# EAGLE design scheme (EAGLE 6.5.0)
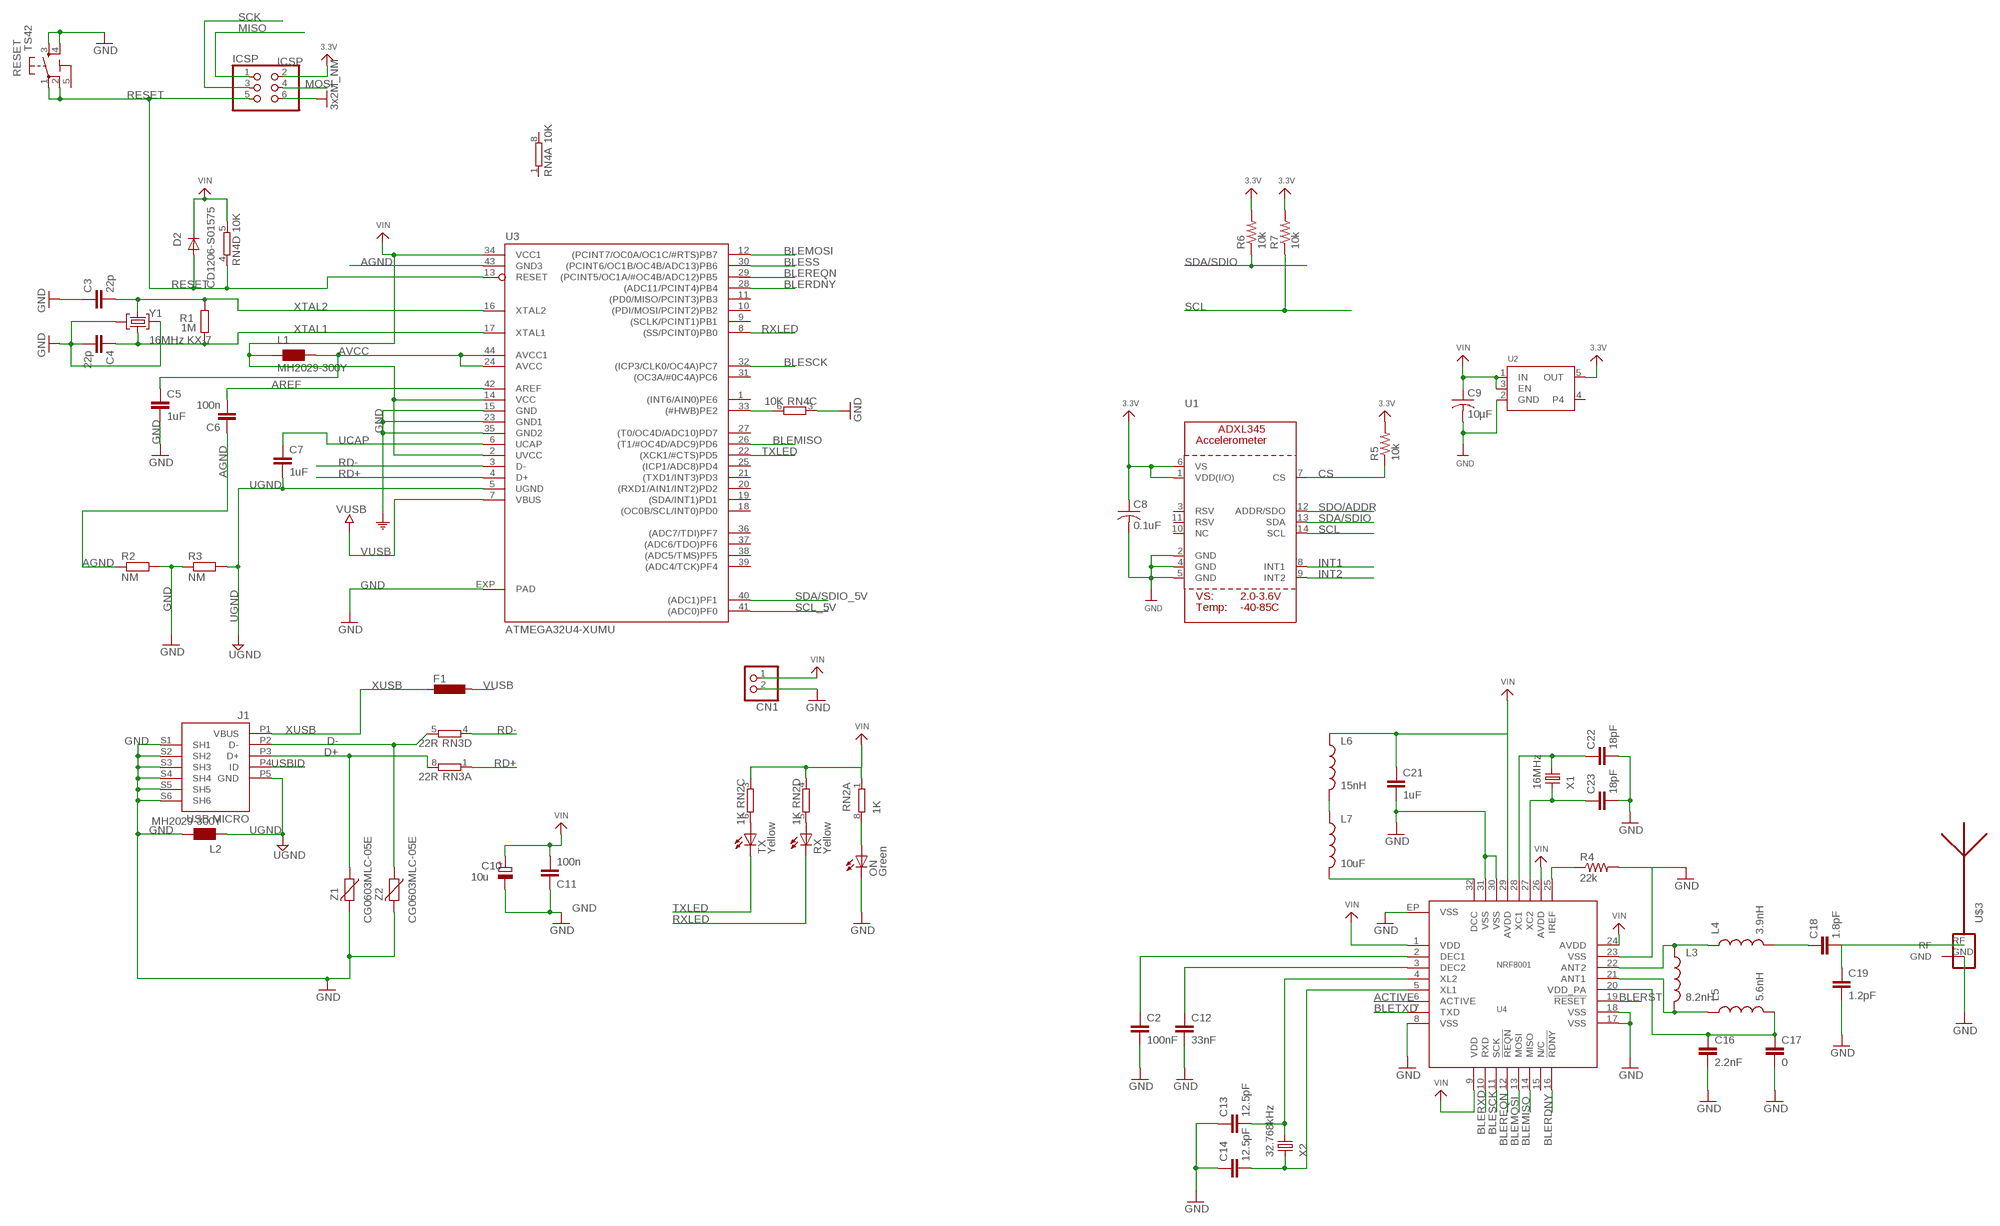
[diagram p0: schematic, sheet 1]

## Parts
C2  100nF  CAP0603-CAP  [0603-CAP]
C3  22p  C-EUC0603  [C0603-ROUND]
C4  22p  C-EUC0603  [C0603-ROUND]
C5  1uF  C-EUC0603  [C0603-ROUND]
C6  100n  C-EUC0603  [C0603-ROUND]
C7  1uF  C-EUC0603  [C0603-ROUND]
C8  0.1uF  C-USC0805  [C0805]
C9  10µF  C-USC0805  [C0805]
C10  10u  CPOL-EUSMCB  [SMC_B]
C11  100n  C-EUC0603  [C0603-ROUND]
C12  33nF  CAP0603-CAP  [0603-CAP]
C13  12.5pF  CAP0603-CAP  [0603-CAP]
C14  12.5pF  CAP0603-CAP  [0603-CAP]
C16  2.2nF  CAP0603-CAP  [0603-CAP]
C17  0  CAP0603-CAP  [0603-CAP]
C18  1.8pF  CAP0603-CAP  [0603-CAP]
C19  1.2pF  CAP0603-CAP  [0603-CAP]
C21  1uF  CAP0603-CAP  [0603-CAP]
C22  18pF  CAP0603-CAP  [0603-CAP]
C23  18pF  CAP0603-CAP  [0603-CAP]
CN1  JST_2PIN-SMT-RA  [JST-PH-2-SMT-RA]
D2  CD1206-S01575  DIODE-MINIMELF  [MINIMELF]
F1  MF-MSMF050-2 500mA  L-EUL1812  [L1812]
ICSP  ICSP  PINHD-2X3  [2X03]
J1  USB MICRO  MYCON2_USB-MINI-B  [CON2_USB_MICRO_B_AT]
L1  MH2029-300Y  WE-CBF_0805  [0805]
L2  MH2029-300Y  WE-CBF_0805  [0805]
L3  8.2nH  INDUCTOR0603  [0603]
L4  3.9nH  INDUCTOR0603  [0603]
L5  5.6nH  INDUCTOR0603  [0603]
L6  15nH  INDUCTOR0603  [0603]
L7  10uF  INDUCTOR0603  [0603]
ON  Green  LEDCHIPLED_0805  [CHIPLED_0805]
R1  1M  R-EU_R0603  [R0603-ROUND]
R2  NM  R-EU_R0402  [R0402]
R3  NM  R-EU_R0402  [R0402]
R4  22k  RESISTOR0603-RES  [0603-RES]
R5  10k  RESISTOR0603-RES  [0603-RES]
R6  10k  RESISTOR0603-RES  [0603-RES]
R7  10k  RESISTOR0603-RES  [0603-RES]
RESET  TS42  [TS42]
RN2  1K  4R-NCAY16  [CAY16]
RN3  22R  4R-NCAY16  [CAY16]
RN4  10K  4R-NCAY16  [CAY16]
RX  Yellow  LEDCHIPLED_0805  [CHIPLED_0805]
TX  Yellow  LEDCHIPLED_0805  [CHIPLED_0805]
U1  ACCEL_ADXL345  [LGA14]
U2  VREG_SOT23-5  [SOT23-5]
U3  ATMEGA32U4-XUMU  [QFN44ML7X7]
U4  NRF8001  [QFN-32]
U$3  ANTENNA_1LEFT  [SWRA117D_LEFT]
X1  16MHz  CRYSTAL-2.5X3.5  [CRYSTAL-2.5X3.5]
X2  32.768kHz  CRYSTAL-ABS10  [CRYSTAL-ABS10]
Y1  16MHz KX-7  CRYSTAL-3.2-2.5  [CRYSTAL-3.2-2.5]
Z1  CG0603MLC-05E  VARISTORCN0603  [CT/CN0603]
Z2  CG0603MLC-05E  VARISTORCN0603  [CT/CN0603]

## Nets
3.3V: C8.1 ICSP.2 R5.2 R6.2 R7.2 U1.1(VDD(I/O)) U1.6(VS) U2.5(OUT)
ACTIVE: U4.6(ACTIVE)
AGND: C6.1 R2.1 U3.43(GND3)
AREF [aref]: C6.2 U3.42(AREF)
AVCC: C5.1 L1.2 U3.24(AVCC) U3.44(AVCC1)
BLEMISO: U3.26((T1/#OC4D/ADC9)PD6) U4.14(MISO)
BLEMOSI: U3.12((PCINT7/OC0A/OC1C/#RTS)PB7) U4.13(MOSI)
BLERDNY: U3.28((ADC11/PCINT4)PB4) U4.16(!RDNY)
BLEREQN: U4.12(!REQN)
BLERST: U4.19(!RESET)
BLERXD: U4.10(RXD)
BLESCK: U3.32((ICP3/CLK0/OC4A)PC7) U4.11(SCK)
BLESS: U3.30((PCINT6/OC1B/OC4B/ADC13)PB6)
BLETXD: U4.7(TXD)
CS: R5.1 U1.7(CS)
D+: J1.P3(D+) RN3.8 Z1.1
D-: J1.P2(D-) RN3.5 Z2.1
GND: C2.2 C3.1 C4.2 C5.2 C8.2 C9.2 C10.- C11.1 C12.2 C13.1 C14.1 C16.2 C17.2 C19.2 C21.2 C22.2 C23.2 CN1.2 ICSP.6 J1.S1(SH1) J1.S2(SH2) J1.S3(SH3) J1.S4(SH4) J1.S5(SH5) J1.S6(SH6) L2.2 ON.C R2.2 R3.1 R4.2 RESET.3 RESET.4 RN4.3 U1.2(GND) U1.4(GND) U1.5(GND) U2.2(GND) U3.15(GND) U3.23(GND1) U3.35(GND2) U3.EXP(PAD) U4.8(VSS) U4.17(VSS) U4.18(VSS) U4.23(VSS) U4.30(VSS) U4.31(VSS) U4.EP(VSS) U$3.GND Y1.2(GND) Y1.4(GND) Z1.2 Z2.2 ; supply symbol labelled 3x2M_NM, COM
HWB: RN4.6
INT1: U1.8(INT1)
INT2: U1.9(INT2)
MISO: ICSP.1
MOSI: ICSP.4
N$1: L6.2 L7.1
N$2: L7.2 U4.32(DCC)
N$3: ON.A RN2.8
N$5: C2.1 U4.2(DEC1)
N$6: RN2.6 TX.A
N$7: C12.1 U4.3(DEC2)
N$8: RN2.5 RX.A
N$9: L3.1 L4.1 U4.22(ANT2)
N$10: L3.2 L5.1 U4.21(ANT1)
N$11: C18.1 L4.2
N$12: C18.2 C19.1 U$3.RF
N$13: C16.1 C17.1 L5.2 U4.20(VDD_PA)
N$14: R4.1 U4.25(IREF)
N$15: C23.1 U4.27(XC2) X1.P$1
N$16: C22.1 U4.28(XC1) X1.P$3
N$17: C13.2 U4.4(XL2) X2.P$2
N$18: C14.2 U4.5(XL1) X2.P$1
RD+: RN3.1 U3.4(D+)
RD-: RN3.4 U3.3(D-)
RESET: D2.A ICSP.5 RESET.1 RESET.2 RN4.4 U3.13(RESET)
RXLED: RX.C U3.8((SS/PCINT0)PB0)
SCK: ICSP.3
SCL: R7.1 U1.14(SCL)
SCL_5V: U3.41((ADC0)PF0)
SDA/SDIO: R6.1 U1.13(SDA)
SDA/SDIO_5V: U3.40((ADC1)PF1)
SDO/ADDR: U1.12(ADDR/SDO)
TXLED: TX.C U3.22((XCK1/#CTS)PD5)
UCAP: C7.1 U3.6(UCAP)
UGND [gnd]: C7.2 J1.P5(GND) L2.1 R3.2 U3.5(UGND)
USBID: J1.P4(ID)
VIN: C9.1 C10.+ C11.2 C21.1 CN1.1 D2.C L1.1 L6.1 RN2.1 RN2.3 RN2.4 RN4.5 U2.1(IN) U2.3(EN) U3.2(UVCC) U3.14(VCC) U3.34(VCC1) U4.1(VDD) U4.9(VDD) U4.24(AVDD) U4.26(AVDD) U4.29(AVDD)
VUSB: F1.1 U3.7(VBUS)
XTAL1: C4.1 R1.1 U3.17(XTAL1) Y1.1(C1)
XTAL2: C3.2 R1.2 U3.16(XTAL2) Y1.3(C2)
XUSB [usbvcc]: F1.2 J1.P1(VBUS)
Unconnected: RN2.2 RN2.7 RN3.2 RN3.3 RN3.6 RN3.7 RN4.1 RN4.2 RN4.7 RN4.8 U1.3(RSV) U1.10(NC) U1.11(RSV) U2.4 U3.1((INT6/AIN0)PE6) U3.9((SCLK/PCINT1)PB1) U3.10((PDI/MOSI/PCINT2)PB2) U3.11((PD0/MISO/PCINT3)PB3) U3.18((OC0B/SCL/INT0)PD0) U3.19((SDA/INT1)PD1) U3.20((RXD1/AIN1/INT2)PD2) U3.21((TXD1/INT3)PD3) U3.25((ICP1/ADC8)PD4) U3.27((T0/OC4D/ADC10)PD7) U3.29((PCINT5/OC1A/#OC4B/ADC12)PB5) U3.31((OC3A/#0C4A)PC6) U3.33((#HWB)PE2) U3.36((ADC7/TDI)PF7) U3.37((ADC6/TDO)PF6) U3.38((ADC5/TMS)PF5) U3.39((ADC4/TCK)PF4) U4.15(N/C)

## Power pins joined to a net without a drawn wire
5-GND: RESET.5(5-GND)

## Library data of the parts
C2 C12-C14 C16-C19 C21-C23 = SparkFun:CAP: Capacitor Standard 0603 ceramic capacitor, and 0.1" leaded capacitor.
C3-C7 C11 = SmartPrj:C-EU: CAPACITOR, European symbol
C8 C9 = adafruit:C-US: CAPACITOR, American symbol
C10 = rcl:CPOL-EU: POLARIZED CAPACITOR, European symbol
CN1 = adafruit:JST_2PIN: JST 2-Pin Connectors of various flavors SMT-RA (S2B-PH-SM4) 4UConnector #17311 SMT (B2B-PH-SM4) THM-RA (S2B-PH) THM (B2B-PH)
D2 = diode:DIODE-: DIODE
F1 = rcl:L-EU: INDUCTOR, European symbol
ICSP = SmartPrj:PINHD-2X3: PIN HEADER
J1 = SmartPrj:MYCON2_USB-MINI-B
L1 L2 = wuerth-elektronik:WE-CBF: SMD EMI Suppression Ferrite Beads - excellent anti-EMI properties - low DCR - impedances till 3000 ohms - rated current up to 6 A
L3-L7 = SparkFun:INDUCTOR: Inductors Basic Inductor/Choke - 0603 and 1206. Footprints are not proven and vary greatly between part numbers.
ON RX TX = led:LED: LED OSRAM: - CHIPLED LG R971, LG N971, LY N971, LG Q971, LY Q971, LO R971, LY R971 LH N974, LH R974 LS Q976, LO Q976, LY Q976 LO Q996 - Hyper CHIPLED LW Q18S LB Q993, LB Q99A, LB R99A - SideLED LS A670, LO A670, LY A670, LG A670, LP A670 LB A673, LV A673, LT A673, LW A673 LH A674 LY A675 LS A676, LA A676, LO A676, LY A676, LW A676 LS A679, LY A679, LG A679 - Hyper Micro SIDELED® LS Y876, LA Y876, LO Y876, LY Y876 LT Y87S - SmartLED LW L88C, LW L88S LB L89C, LB L89S, LG L890 LS L89K, LO L89K, LY L89K LS L896, LA L896, LO L896, LY L896 - TOPLED LS T670, LO T670, LY T670, LG T670, LP T670 LSG T670, LSP T670, LSY T670, LOP T670, LYG T670 LG T671, LOG T671, LSG T671 LB T673, LV T673, LT T673, LW T673 LH T674 LS T676, LA T676, LO T676, LY T676, LB T676, LH T676, LSB T676, LW T676 LB T67C, LV T67C, LT T67C, LS T67K, LO T67K, LY T67K, LW E67C LS E67B, LA E67B, LO E67B, LY E67B, LB E67C, LV E67C, LT E67C LW T67C LS T679, LY T679, LG T679 LS T770, LO T770, LY T770, LG T770, LP T770 LB T773, LV T773, LT T773, LW T773 LH T774 LS E675, LA E675, LY E675, LS T675 LS T776, LA T776, LO T776, LY T776, LB T776 LHGB T686 LT T68C, LB T68C - Hyper Mini TOPLED® LB M676 - Mini TOPLED Santana® LG M470 LS M47K, LO M47K, LY M47K Source: http://www.osram.convergy.de LUXEON: - LUMILED® LXK2-PW12-R00, LXK2-PW12-S00, LXK2-PW14-U00, LXK2-PW14-V00 LXK2-PM12-R00, LXK2-PM12-S00, LXK2-PM14-U00 LXK2-PE12-Q00, LXK2-PE12-R00, LXK2-PE12-S00, LXK2-PE14-T00, LXK2-PE14-U00 LXK2-PB12-K00, LXK2-PB12-L00, LXK2-PB12-M00, LXK2-PB14-N00, LXK2-PB14-P00, LXK2-PB14-Q00 LXK2-PR12-L00, LXK2-PR12-M00, LXK2-PR14-Q00, LXK2-PR14-R00 LXK2-PD12-Q00, LXK2-PD12-R00, LXK2-PD12-S00 LXK2-PH12-R00, LXK2-PH12-S00 LXK2-PL12-P00, LXK2-PL12-Q00, LXK2-PL12-R00 Source: www.luxeon.com KINGBRIGHT: KA-3528ASYC Source: www.kingbright.com
R1-R3 = SmartPrj:R-EU_: RESISTOR, European symbol
R4-R7 = SparkFun:RESISTOR: Resistor Basic schematic elements and footprints for 0603, 1206, and PTH resistors.
RESET = SmartPrj:TS42: TS42 Dongnan Electronics Tact switch VDC 12V - 50mA
RN2-RN4 = resistor-dil:4R-N: Array Chip Resistor Source: RS Component / Phycomp
U1 = microbuilder:ACCEL_ADXL345: ADXL345 - Digital 3-Axis Accelerometer (I2C/SPI)
U2 = microbuilder:VREG_SOT23-5: SOT23-5 Fixed Voltage Regulators Part Current Out V Out V In V Dropout θJA (°C/W) TJ (°C) Digikey Part No. ADP121 150mA 3.3V 3.4-5.5V 0.09V @ 150mA -- -- ADP121-AUJZ33R7CT-ND ADP121 150mA 3.0V 3.1-5.5V 0.09V @ 150mA -- -- ADP121-AUJZ30R7CT-ND ADP122 300mA 3.3V 3.4-5.5V 0.085V @ 300mA -- -- ADP122AUJZ-3.3-R7CT-ND ADP1712 300mA 3.3V 3.5-5.5V 0.17V @ 300mA -- -- ADP1712AUJZ-3.3-R7TR-ND AP7311 (Low Cost) 150mA 3.3V 3.5-6V 0.15V @ 150mA -- -- AP7311-33WG-7DICT-ND LD39015M18R 150mA 1.8V 1.9V-5.5V 0.08V @ 100mA -- -- 497-6977-1-ND LP2985A-33DBVR 150mA 3.3V 3.3-16V 0.28V @ 150mA 206 150 296-18479-1-ND MCP1824T-3302E/OT 300mA 3.3V 3.5V-6V 0.2V @ 300mA -- -- MCP1824T-3302E/OTCT-ND MIC5205-2.5YM5 TR 150mA 2.5V 2.7-16V 0.165V @ 150mA -- -- 576-1257-2-ND MIC5205-3.0YM5 TR 150mA 3.0V 3.2V-16V 0.165V @ 150mA -- -- 576-1258-2-ND MIC5205-3.3YM5 TR 150mA 3.3V 3.5V-16V 0.165V @ 150mA -- -- 576-1259-2-ND TPS780330220 150mA 3.3V+2.2V 3.6-5.5V 250mV Max -- -- 296-23332-1-ND TDA3663/N1,135 100mA 3.3V 3.5-45V 0.18V @ 50mA -- -- 568-5343-1-ND Max operating temp can be calculated using θJA, TJ (max junction temperature), and power in watts. Set the "Maximum Ambient Temperature" until it reaches TJ ("Max Junction Temperature"), which is the absolute limit for safe use of the regulator: Heat Sink Temperature Calculator <http://www.daycounter.com/Calculators/Heat-Sink-Temperature-Calculator.phtml> For example, With 12V source into a 3.3V LP2985 and a 30mA load, we are dissipating (12V-3.3V) * 0.03A = 0.261W. With a θJA of 206 °C/W, a TJ of 150°C, and 261mW we can safely use the chip without a heat sink up to 75°C (=147.1°C Junction Temperature).
U3 = SmartPrj:ATMEGA32U4-XU
U4 = FitnessDevice:NRF8001: nRF8001 is a Bluetooth® low energy solution designed for operation in the peripheral role. By integrating a Bluetooth low energy compliant radio (PHY), slave mode link controller and host, nRF8001 offers you an easy way to add Bluetooth low energy connectivity to your application.
U$3 = ant-planar-1:ANTENNA_1
X1 = FitnessDevice:CRYSTAL-2.5X3.5: ABRACON - ABM8G-16.000MHZ-B4Y-T - Crystal Newark Part Number: 60R3957
X2 = FitnessDevice:CRYSTAL-ABS10: ABS10-32.768KHZ-9-T
Y1 = SmartPrj:CRYSTAL-3.2-2.5
Z1 Z2 = varistor:VARISTOR: VARISTOR

## Net classes
1 power: width 0.254 mm, drill 0.61 mm, clearance 0.254 mm
2 gnd: width 0.254 mm, drill 0.61 mm, clearance 0.254 mm
3 usbvcc: width 0.254 mm, drill 0.61 mm, clearance 0.254 mm
4 aref: width 0.254 mm, drill 0.61 mm, clearance 0.254 mm

## Board
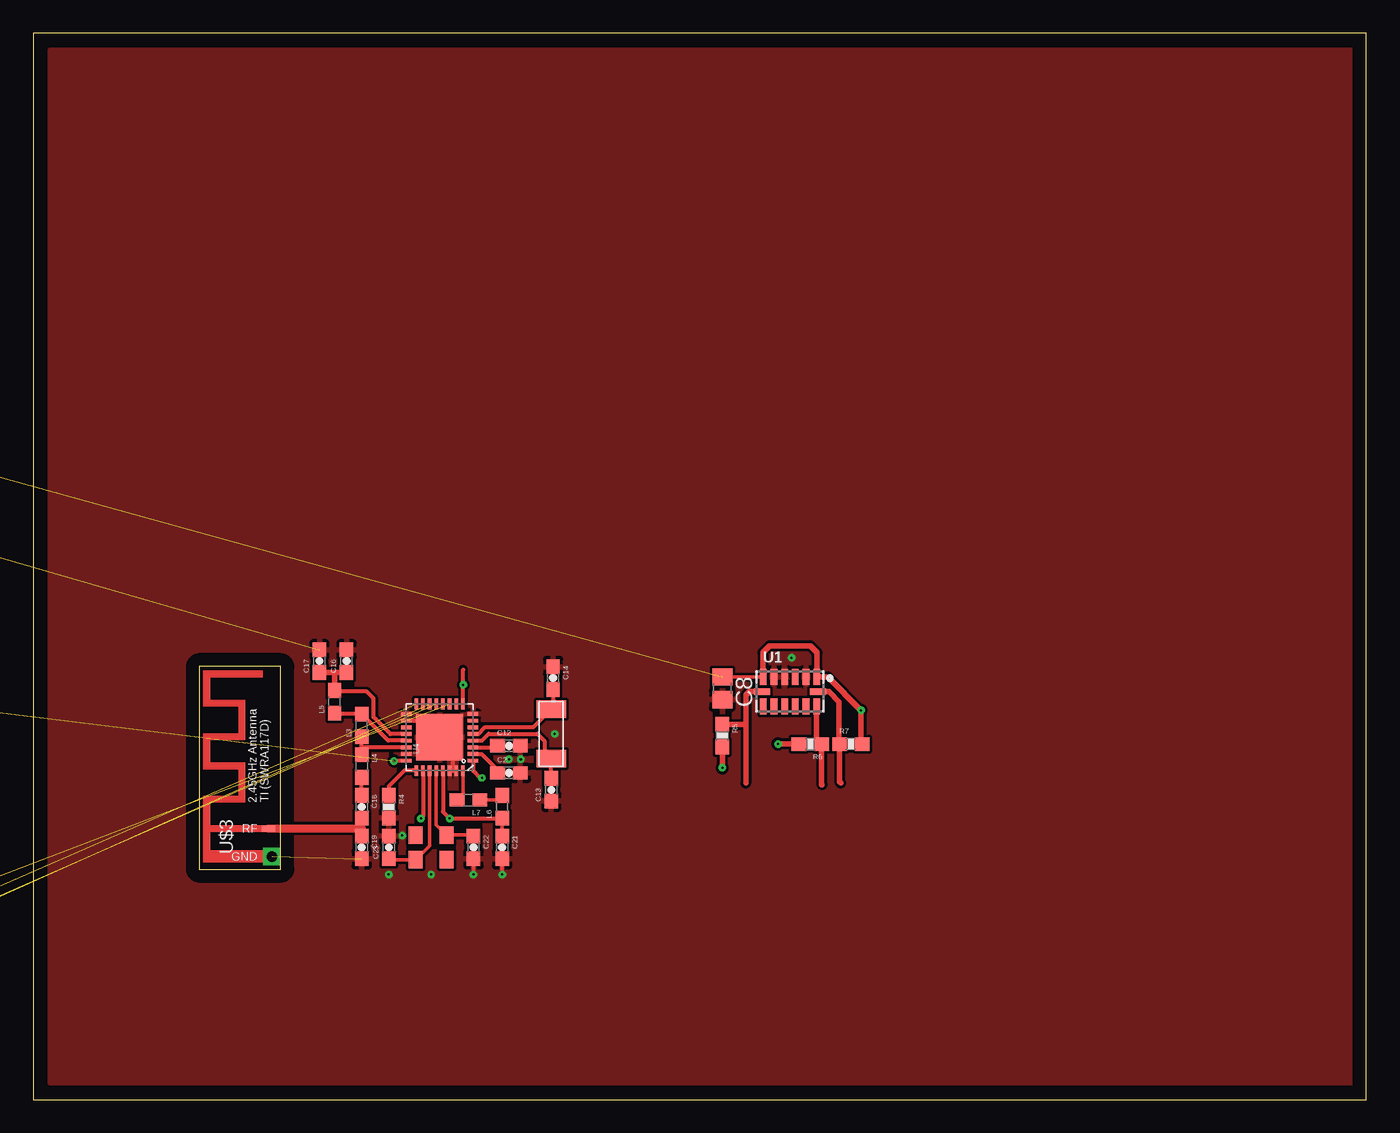
[diagram p1: board, top side]
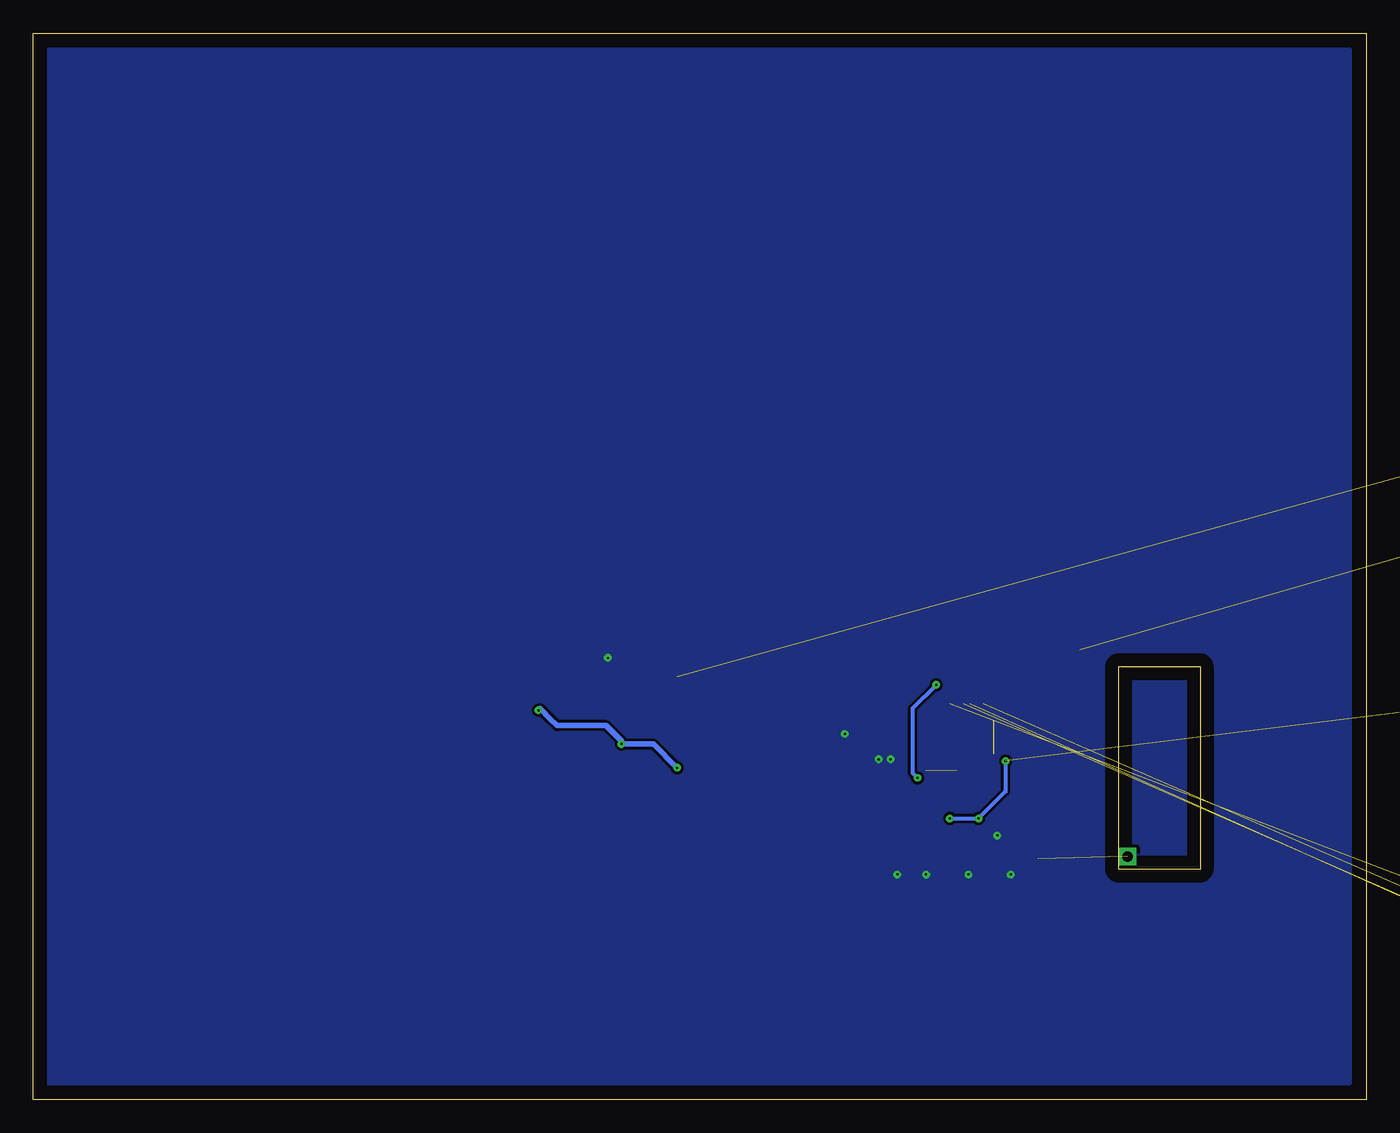
[diagram p2: board, bottom side, seen from below]

Size 100 x 80 mm. Coordinates in mm from the lower left corner, seen from the top.
Outline: 0,0 100,0 100,80 0,80 0,0
Copper layers (1*16): Top 0.035mm / dielectric 1.5mm / Bottom 0.035mm
Design rules "default": minimum track width 10mil, minimum drill 24mil, track to track 8mil, track to pad 8mil, pad to pad 8mil, via to via 8mil, smd to smd 8mil, copper to edge 40mil, drill to drill 8mil, minimum pad ring 10mil, minimum via ring 8mil, stop-mask expansion 4mil, vias tented up to drill 0mil, thermal gap 10mil

### Footprints (pad centres in the part's own frame; a part is rotated, then mirrored left to right if it is on the bottom)
0603-CAP = smd 1.1 x 1: 1 -0.85,0; 2 0.85,0
C0603-ROUND = smd 0.898 x 1.1: 1 -0.889,0; 2 0.889,0
C0805 = smd 1.3 x 1.5: 1 -0.85,0; 2 0.85,0
SMC_B = smd 1.6 x 2.4: + -1.5,0; - 1.5,0
JST-PH-2-SMT-RA = smd 1 x 4.6: 1 1,-3.7; 2 -1,-3.7 | smd 1.6 x 3.4: NC1 -3.4,1.5; NC2 3.4,1.5
MINIMELF = smd 1.4 x 1.8: A 1.7,0; C -1.7,0
L1812 = smd 1.9 x 3.4: 1 -1.95,0; 2 1.95,0
2X03 = drill 0.95 pad 1.55 octagon: 1 -2.54,-1.27; 2 -2.54,1.27; 3 0,-1.27; 4 0,1.27; 5 2.54,-1.27; 6 2.54,1.27
CON2_USB_MICRO_B_AT = smd 0.406 x 1.346: P1 -1.321,2.692; P2 -0.66,2.692; P3 0,2.692; P4 0.66,2.692; P5 1.321,2.692 | smd 1.651 x 1.549: S1 -3.302,0; S2 3.302,0 | smd 1.524 x 1.016: S3 -2.489,2.692; S4 2.489,2.692 | smd 1.524 x 1.524: S5 -1.016,0; S6 1.016,0 | hole 0.7: -3.505,0.254; -3.505,-0.254; 3.505,0.254; 3.505,-0.254; -2.616,2.692; -2.362,2.692; 2.362,2.692; 2.616,2.692
0805 = smd 1.2 x 1: 1 -1.1,0; 2 1.1,0
0603 = smd 1.1 x 1: 1 -0.85,0; 2 0.85,0
CHIPLED_0805 = smd 1.2 x 1.2: A 0,-1.05; C 0,1.05
R0603-ROUND = smd 0.898 x 1.1: 1 -0.889,0; 2 0.889,0
R0402 = smd 0.7 x 0.9: 1 -0.65,0; 2 0.65,0
0603-RES = smd 1.1 x 1: 1 -0.85,0; 2 0.85,0
TS42 = smd 1.6 x 1.4: 1 -4.2,2.25; 2 4.2,2.25; 3 -4.2,-2.25; 4 4.2,-2.25; 5 -4.2,0
CAY16 = smd 0.5 x 0.65: 1 -1.2,-0.675; 2 -0.4,-0.675; 3 0.4,-0.675; 4 1.2,-0.675; 5 1.2,0.675; 6 0.4,0.675; 7 -0.4,0.675; 8 -1.2,0.675
LGA14 = smd 0.5 x 1.2: 1 2,1.1; 2 1.2,1.1; 3 0.4,1.1; 4 -0.4,1.1; 5 -1.2,1.1; 6 -2,1.1; 8 -2,-1.1; 9 -1.2,-1.1; 10 -0.4,-1.1; 11 0.4,-1.1; 12 1.2,-1.1; 13 2,-1.1 | smd 1.2 x 0.5: 7 -2.1,0; 14 2.1,0
SOT23-5 = smd 0.55 x 1.2: 1 -0.95,-1.3; 2 0,-1.3; 3 0.95,-1.3; 4 0.95,1.3; 5 -0.95,1.3
QFN44ML7X7 = smd 0.75 x 0.275: 1 -3.275,2.5; 2 -3.275,2; 3 -3.275,1.5; 4 -3.275,1; 5 -3.275,0.5; 6 -3.275,0; 7 -3.275,-0.5; 8 -3.275,-1; 9 -3.275,-1.5; 10 -3.275,-2; 11 -3.275,-2.5; 23 3.275,-2.5; 24 3.275,-2; 25 3.275,-1.5; 26 3.275,-1; 27 3.275,-0.5; 28 3.275,0; 29 3.275,0.5; 30 3.275,1; 31 3.275,1.5; 32 3.275,2; 33 3.275,2.5 | smd 0.275 x 0.75: 12 -2.5,-3.275; 13 -2,-3.275; 14 -1.5,-3.275; 15 -1,-3.275; 16 -0.5,-3.275; 17 0,-3.275; 18 0.5,-3.275; 19 1,-3.275; 20 1.5,-3.275; 21 2,-3.275; 22 2.5,-3.275; 34 2.5,3.275; 35 2,3.275; 36 1.5,3.275; 37 1,3.275; 38 0.5,3.275; 39 0,3.275; 40 -0.5,3.275; 41 -1,3.275; 42 -1.5,3.275; 43 -2,3.275; 44 -2.5,3.275 | smd 4.826 x 4.826: EXP 0,0
QFN-32 = smd 0.285 x 0.8: 1 -1.75,-2.5; 2 -1.25,-2.5; 3 -0.75,-2.5; 4 -0.25,-2.5; 5 0.25,-2.5; 6 0.75,-2.5; 7 1.25,-2.5; 8 1.75,-2.5; 17 1.75,2.5; 18 1.25,2.5; 19 0.75,2.5; 20 0.25,2.5; 21 -0.25,2.5; 22 -0.75,2.5; 23 -1.25,2.5; 24 -1.75,2.5 | smd 0.8 x 0.285: 9 2.5,-1.75; 10 2.5,-1.25; 11 2.5,-0.75; 12 2.5,-0.25; 13 2.5,0.25; 14 2.5,0.75; 15 2.5,1.25; 16 2.5,1.75; 25 -2.5,1.75; 26 -2.5,1.25; 27 -2.5,0.75; 28 -2.5,0.25; 29 -2.5,-0.25; 30 -2.5,-0.75; 31 -2.5,-1.25; 32 -2.5,-1.75 | smd 3.5 x 3.5: EP 0,0
SWRA117D_LEFT = drill 0.8 square: GND 0.45,0.25 | smd 0.508 x 1.016: RF 2.55,0.51
CRYSTAL-2.5X3.5 = smd 1.05 x 1.3: P$1 -1.15,-0.925; P$2 1.15,-0.925; P$3 1.15,0.925; P$4 -1.15,0.925
CRYSTAL-ABS10 = smd 1.3 x 2.2: P$1 -1.85,0; P$2 1.85,0
CRYSTAL-3.2-2.5 = smd 1.3 x 1.05: 1 -1.15,-0.925; 2 1.15,-0.925; 3 1.15,0.925; 4 -1.15,0.925
CT/CN0603 = smd 1 x 1: 1 -1,0; 2 1,0

### Placement (x,y rotation side)
C2  35.69,24.51 0 top
C3  -26.67,44.45 0 top  (outside the outline)
C4  -31.75,44.45 0 top  (outside the outline)
C5  -16.51,44.45 0 top  (outside the outline)
C6  -41.91,38.1 0 top  (outside the outline)
C7  -21.59,44.45 0 top  (outside the outline)
C8  51.69,30.86 270 top
C9  -24.13,38.1 0 top  (outside the outline)
C10  -53.34,16.51 0 top  (outside the outline)
C11  -46.99,38.1 0 top  (outside the outline)
C12  35.69,26.54 0 top
C13  38.86,23.24 90 top
C14  38.99,31.62 270 top
C16  23.5,32.89 90 top
C17  21.46,32.89 90 top
C18  24.64,21.97 270 top
C19  24.64,18.92 270 top
C21  35.18,18.92 270 top
C22  33.02,18.92 270 top
C23  26.67,18.92 90 top
CN1  -36.83,7.62 0 top  (outside the outline)
D2  -53.34,31.75 0 top  (outside the outline)
F1  -31.75,17.78 0 top  (outside the outline)
ICSP  -57.15,5.08 0 top  (outside the outline)
J1  -34.29,24.13 0 top  (outside the outline)
L1  -22.86,49.53 0 top  (outside the outline)
L2  -30.48,49.53 0 top  (outside the outline)
L3  24.64,28.07 90 top
L4  24.64,25.02 270 top
L5  22.61,29.84 90 top
L6  35.18,21.97 90 top
L7  32.64,22.48 180 top
ON  -54.61,24.13 0 top  (outside the outline)
R1  -29.21,38.1 0 top  (outside the outline)
R2  -52.07,38.1 0 top  (outside the outline)
R3  -57.15,38.1 0 top  (outside the outline)
R4  26.67,21.97 270 top
R5  51.69,27.3 270 top
R6  58.29,26.67 180 top
R7  61.34,26.67 0 top
RESET  -46.99,5.08 0 top  (outside the outline)
RN2  -20.32,31.75 0 top  (outside the outline)
RN3  -25.4,31.75 0 top  (outside the outline)
RN4  -30.48,31.75 0 top  (outside the outline)
RX  -16.51,24.13 0 top  (outside the outline)
TX  -22.86,24.13 0 top  (outside the outline)
U1  56.77,30.61 0 top
U2  -16.51,49.53 0 top  (outside the outline)
U3  -27.94,6.35 0 top  (outside the outline)
U4  30.48,27.18 90 top
U$3  18.16,17.78 90 top
X1  29.84,18.92 0 top
X2  38.86,27.43 270 top
Y1  -48.26,25.4 0 top  (outside the outline)
Z1  -44.45,44.45 0 top  (outside the outline)
Z2  -58.42,44.45 0 top  (outside the outline)

### Tracks (layer width: path | path; a pad name or v marks a point on that pad's centre or on a via)
3.3V  (via drill 0.15)  (2 unrouted)
  Top 0.254: C8.1 U1.6
  Top 0.406: U1.6 54.74,31.74 54.74,33.53 55.24,34.04 57.4,34.04 58.29,34.04 58.8,33.53 58.8,31.71 U1.1 59.61,31.71 v62.1,29.21 62.1,26.76 R7.2 | R6.2 v55.88,26.67 | v51.69,24.89 R5.2
  Bottom 0.406: 61.21,28.57 60.71,28.07 57.02,28.07 55.88,26.92 v55.88,26.67 53.47,26.67 v51.69,24.89 | 61.21,28.57 61.98,29.34 | v62.1,29.21 61.85,29.21 61.21,28.57
AGND  (2 unrouted)
AREF  (1 unrouted)
AVCC  (3 unrouted)
BLEMISO  (1 unrouted)
BLEMOSI  (1 unrouted)
BLERDNY  (1 unrouted)
BLESCK  (1 unrouted)
CS
  Top 0.406: U1.7 53.72,30.61 53.47,30.35 53.47,28.19 | 53.47,28.19 53.47,23.75 | R5.1 53.43,28.16 53.47,28.19
D+  (2 unrouted)
D-  (2 unrouted)
GND  (via drill 0.15)  (32 unrouted)
  Top 0.254: C22.2 v33.02,16.89 | C21.2 v35.18,16.89
  Top 0.305: U4.30 31.46,24.68 31.5,24.64 31.5,25.53 31.5,26.16 U4.EP 29.84,27.81 29.84,28.45 29.82,28.43 U4.18
  other vias: 26.67,16.89 29.84,16.89 35.69,25.53 36.58,25.53 39.12,27.43 27.69,19.81 56.9,33.15
  pour Top: 1.27,1.27 99.06,1.27 99.06,78.74 1.27,78.74
  pour Bottom: 1.27,1.27 99.06,1.27 99.06,78.74 1.27,78.74
N$1
  Top 0.254: L7.1 34.84,22.48 L6.2
N$2
  Top 0.254: U4.32 32.23,22.92 L7.2
N$3  (1 unrouted)
N$5
  Top 0.305: C2.1 34.84,24.73 33.66,25.91 33,25.91 U4.2
N$6  (1 unrouted)
N$7
  Top 0.305: U4.3 34.72,26.43 C12.1
N$8  (1 unrouted)
N$9
  Top 0.305: L4.1 24.64,26.42 | 24.64,26.42 L3.1 | U4.22 24.65,26.43 24.64,26.42
N$10
  Top 0.305: L5.1 22.68,28.92 L3.2 26.63,26.93 U4.21
N$11
  Top 0.305: C18.1 L4.2
N$12
  Top 0.305: C19.1 24.64,20.32 C18.2
  Top 0.61: U$3.RF 24.63,20.33 24.64,20.32
N$13
  Top 0.305: U4.20 26.8,27.43 25.53,28.7 25.53,30.1 25.02,30.61 22.69,30.61 L5.2
  Top 0.406: C16.1 22.61,32.04 | 22.61,32.04 C17.1 | L5.2 22.61,32.04
N$14
  Top 0.305: U4.25 27.85,24.68 26.67,23.5 R4.1
N$15
  Top 0.254: U4.27 29.73,19.03 X1.P$1 26.75,18 C23.1
N$16
  Top 0.254: U4.28 30.23,20.61 X1.P$3 32.95,19.85 C22.1
N$17
  Top 0.305: U4.4 33.66,26.93 34.16,27.43 37.85,27.43 38.35,26.92 38.35,26.09 X2.P$2 | 38.41,26.04 X2.P$2 | C13.2 X2.P$2
N$18
  Top 0.305: U4.5 33.4,27.43 33.91,27.94 37.52,27.94 X2.P$1 38.99,29.41 C14.2
RD+  (1 unrouted)
RD-  (1 unrouted)
RESET  (5 unrouted)
RXLED  (1 unrouted)
SCL
  Top 0.406: U1.14 59.69,30.61 60.45,29.84 60.45,26.71 R7.1 60.49,23.84 60.58,23.75
SDA/SDIO
  Top 0.406: 59.18,23.62 59.14,23.66 R6.1 58.77,27.04 U1.13
TXLED  (1 unrouted)
UCAP  (1 unrouted)
UGND  (4 unrouted)
VIN  (via drill 0.15)  (16 unrouted)
  Top 0.254: C21.1 L6.1
  Top 0.305: U4.24 27.94,25.39 27.06,25.39 v27.05,25.4 | U4.29 30.73,21.59 v31.24,21.08 35.14,21.08 L6.1 | 32.26,32.26 v32.26,31.11 32.23,31.09 U4.9 | v33.66,24.13 33.53,24.13 33.02,24.64 33.02,25.39 U4.1 | U4.26 29.23,21.23 v29.08,21.08
  Bottom 0.305: v32.26,31.11 34.04,29.34 34.04,24.51 v33.66,24.13 | v31.24,21.08 29.97,21.08 v29.08,21.08 27.05,23.11 v27.05,25.4
VUSB  (1 unrouted)
XTAL1  (3 unrouted)
XTAL2  (3 unrouted)
XUSB  (1 unrouted)